# EAGLE design Board (EAGLE 7.1.0)
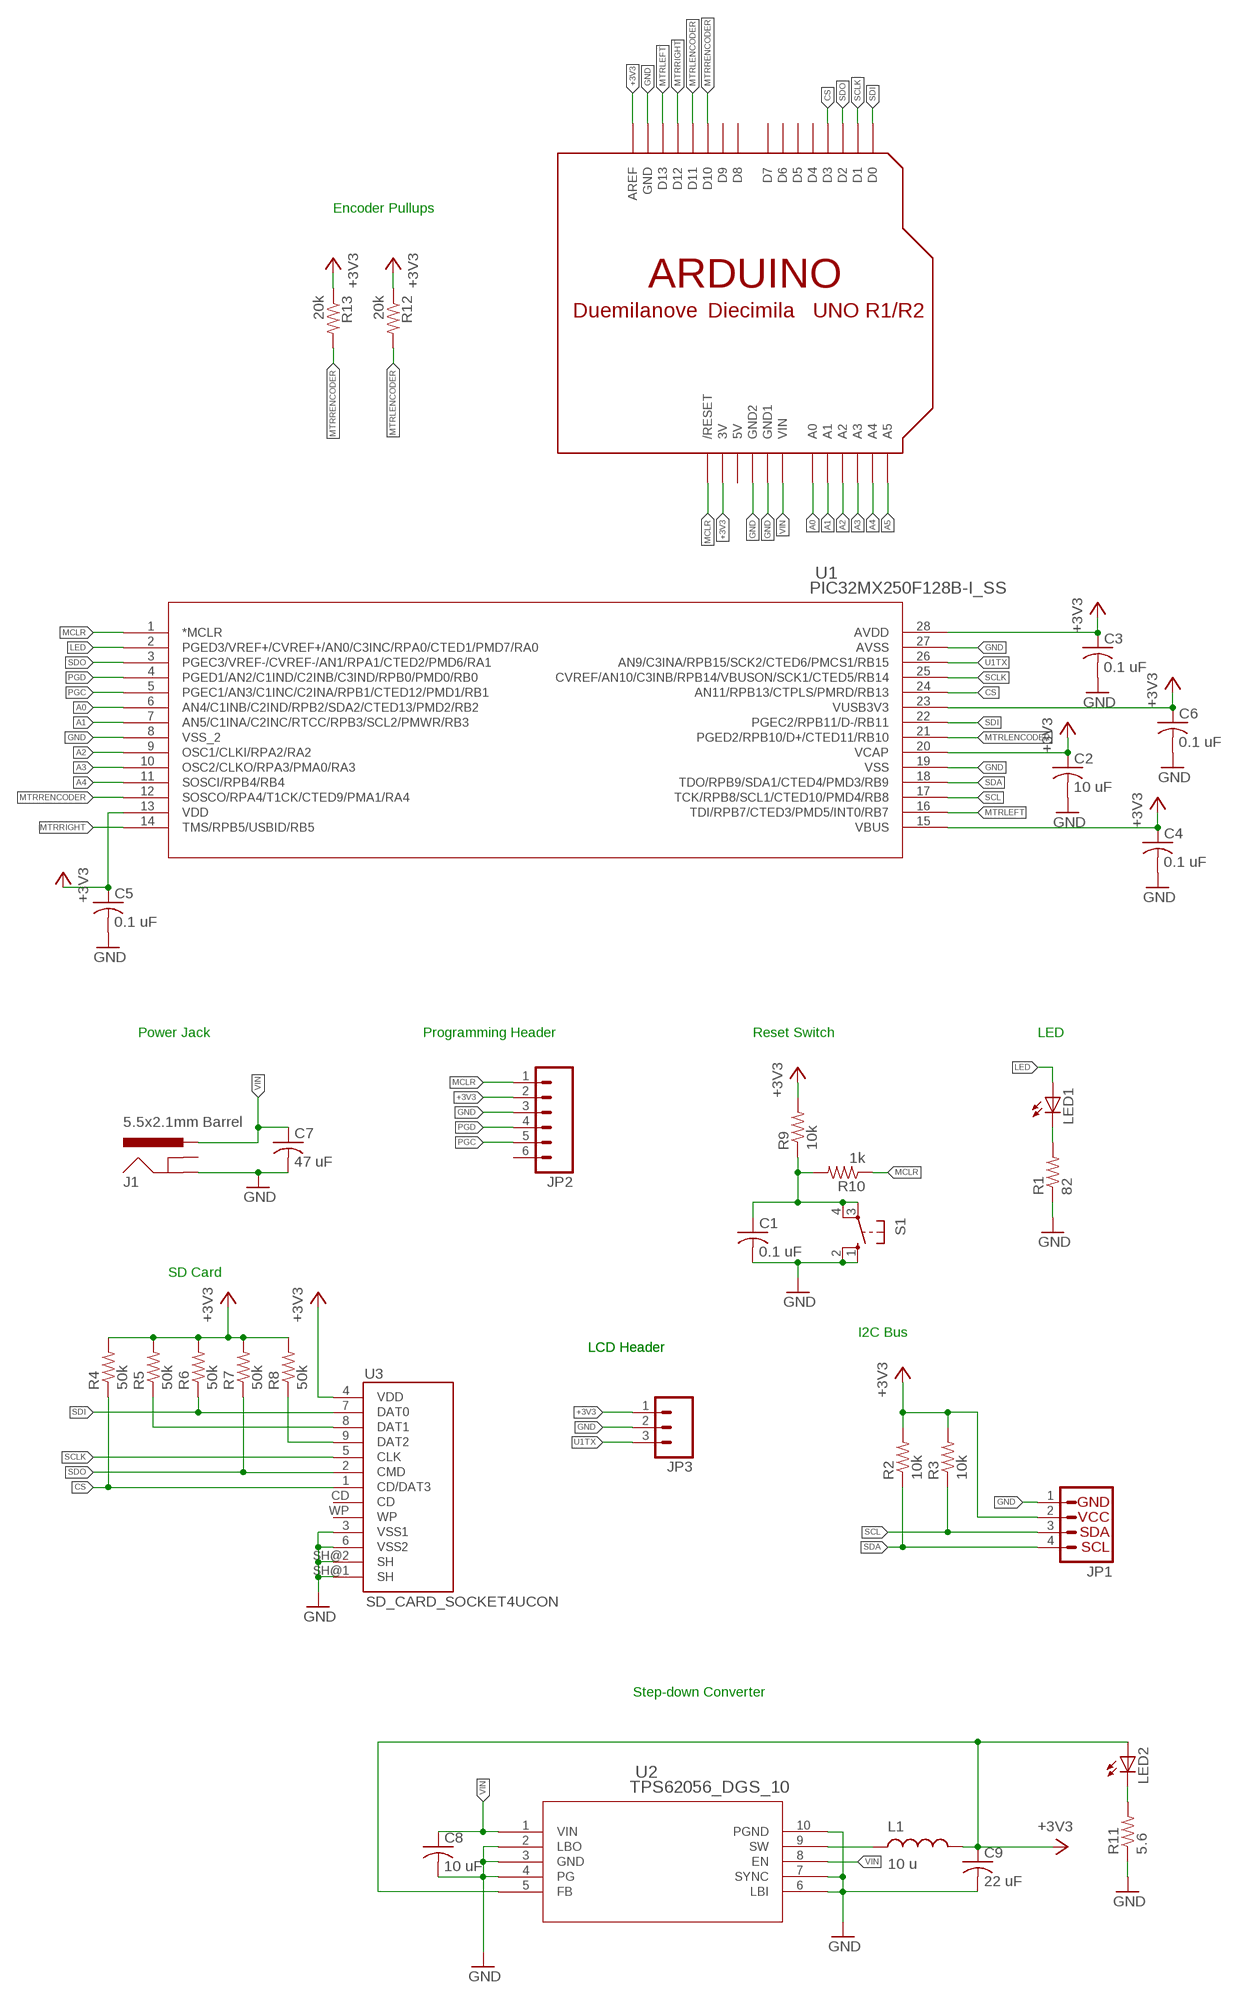
[diagram p0: schematic, sheet 1]

## Parts
C1  0.1 uF  C-USC0805  [C0805]
C2  10 uF  C-USC0805  [C0805]
C3  0.1 uF  C-USC0805  [C0805]
C4  0.1 uF  C-USC0805  [C0805]
C5  0.1 uF  C-USC0805  [C0805]
C6  0.1 uF  C-USC0805  [C0805]
C7  47 uF  C-USC0805  [C0805]
C8  10 uF  C-USC0805  [C0805]
C9  22 uF  C-USC0805  [C0805]
J1  5.5x2.1mm Barrel  POWER_JACKSMD  [POWER_JACK_SMD]
JP1  I2C_STANDARD  [1X04]
JP2  M06SILK_FEMALE_PTH  [1X06]
JP3  M03PTH  [1X03]
L1  10 u  SLF7032T-100M1R4-2PF  [SLF7032T-100M1R4-2PF]
LED1  LEDCHIPLED_1206  [CHIPLED_1206]
LED2  LEDCHIPLED_1206  [CHIPLED_1206]
R1  82  R-US_R1210W  [R1210W]
R2  10k  R-US_R0805W  [R0805W]
R3  10k  R-US_R0805W  [R0805W]
R4  50k  R-US_R0805W  [R0805W]
R5  50k  R-US_R0805W  [R0805W]
R6  50k  R-US_R0805W  [R0805W]
R7  50k  R-US_R0805W  [R0805W]
R8  50k  R-US_R0805W  [R0805W]
R9  10k  R-US_R0805W  [R0805W]
R10  1k  R-US_R0805W  [R0805W]
R11  5.6  R-US_R1210W  [R1210W]
R12  20k  R-US_R0805W  [R0805W]
R13  20k  R-US_R0805W  [R0805W]
S1  10-XX  [B3F-10XX]
U1  PIC32MX250F128B-I_SS  [SSOP28_MC]
U2  TPS62056_DGS_10  [DGS10]
U3  SD_CARD_SOCKET4UCON  [SDCARD_4UCONN]
U$1  ARDUINO-NOHOLE  [ARDUINO-NOHOLE]

## Nets
+3V3: C2.1 C3.1 C4.1 C5.1 C6.1 C9.1 JP1.2 JP2.2 JP3.1 L1.P$2 LED2.A R2.2 R3.2 R4.2 R5.2 R6.2 R7.2 R8.2 R9.2 R12.1 R13.1 U1.13(VDD) U1.15(VBUS) U1.20(VCAP) U1.23(VUSB3V3) U1.28(AVDD) U2.5(FB) U3.4(VDD) U$1.3V U$1.AREF
A0: U1.6(AN4/C1INB/C2IND/RPB2/SDA2/CTED13/PMD2/RB2) U$1.A0
A1: U1.7(AN5/C1INA/C2INC/RTCC/RPB3/SCL2/PMWR/RB3) U$1.A1
A2: U1.9(OSC1/CLKI/RPA2/RA2) U$1.A2
A3: U1.10(OSC2/CLKO/RPA3/PMA0/RA3) U$1.A3
A4: U1.11(SOSCI/RPB4/RB4) U$1.A4
A5: U$1.A5
CS: R4.1 U1.24(AN11/RPB13/CTPLS/PMRD/RB13) U3.1(CD/DAT3) U$1.D3
GND: C1.2 C2.2 C3.2 C4.2 C5.2 C6.2 C7.2 C8.2 C9.2 J1.P$4(GND) JP1.1 JP2.3 JP3.2 R1.1 R11.1 S1.1(S) S1.2(S1) U1.8(VSS_2) U1.19(VSS) U1.27(AVSS) U2.2(LBO) U2.3(GND) U2.4(PG) U2.6(LBI) U2.7(SYNC) U2.10(PGND) U3.3(VSS1) U3.6(VSS2) U3.SH@1(SH) U3.SH@2(SH) U$1.GND U$1.GND1 U$1.GND2
LED: LED1.A U1.2(PGED3/VREF+/CVREF+/AN0/C3INC/RPA0/CTED1/PMD7/RA0)
MCLR: JP2.1 R10.1 U1.1(*MCLR) U$1.RESET(/RESET)
MTRLEFT: U1.16(TDI/RPB7/CTED3/PMD5/INT0/RB7) U$1.D13
MTRLENCODER: R12.2 U1.21(PGED2/RPB10/D+/CTED11/RB10) U$1.D11
MTRRENCODER: R13.2 U1.12(SOSCO/RPA4/T1CK/CTED9/PMA1/RA4) U$1.D10
MTRRIGHT: U1.14(TMS/RPB5/USBID/RB5) U$1.D12
N$1: LED1.C R1.2
N$2: R8.1 U3.9(DAT2)
N$3: R5.1 U3.8(DAT1)
N$4: C1.1 R9.1 R10.2 S1.3(P) S1.4(P1)
N$5: LED2.C R11.2
N$21: L1.P$1 U2.9(SW)
PGC: JP2.5 U1.5(PGEC1/AN3/C1INC/C2INA/RPB1/CTED12/PMD1/RB1)
PGD: JP2.4 U1.4(PGED1/AN2/C1IND/C2INB/C3IND/RPB0/PMD0/RB0)
SCL: JP1.3 R3.1 U1.17(TCK/RPB8/SCL1/CTED10/PMD4/RB8)
SCLK: U1.25(CVREF/AN10/C3INB/RPB14/VBUSON/SCK1/CTED5/RB14) U3.5(CLK) U$1.D1
SDA: JP1.4 R2.1 U1.18(TDO/RPB9/SDA1/CTED4/PMD3/RB9)
SDI: R6.1 U1.22(PGEC2/RPB11/D-/RB11) U3.7(DAT0) U$1.D0
SDO: R7.1 U1.3(PGEC3/VREF-/CVREF-/AN1/RPA1/CTED2/PMD6/RA1) U3.2(CMD) U$1.D2
U1TX: JP3.3 U1.26(AN9/C3INA/RPB15/SCK2/CTED6/PMCS1/RB15)
VIN: C7.1 C8.1 J1.VIN0(PWR) U2.1(VIN) U2.8(EN) U$1.VIN
Unconnected: J1.GND(GNDBREAK) JP2.6 U3.CD U3.WP U$1.D4 U$1.D5 U$1.D6 U$1.D7 U$1.D8 U$1.D9

## Notes on the sheet
- Encoder Pullups
- Power Jack | Programming Header | Reset Switch | LED
- SD Card
- I2C Bus
- LCD Header | LCD Header
- Step-down Converter

## Power pins joined to a net without a drawn wire
5V: U$1.5V

## Library data of the parts
C1-C9 = adafruit:C-US: CAPACITOR, American symbol
J1 = SparkFun-Connectors:POWER_JACK: Power Jack This is the standard 5.5mm barrel jack for power. The PTH is the most common, proven, reliable, footprint. The Slot footprint only works if the mill layer is transmitted to the PCB fab house so be warned. Mating wall wart : TOL-00298 (and others); PROD_ID: CONN-08106
JP1 = SparkFun-Connectors:I2C_STANDARD: SparkFun has standardized on a pinout for all I2C based sensor breakouts. This pinout allows I2C boards to be plugged directly into the headers on Arduino Uno compatible boards, and to be daisy chained easily.
JP2 = SparkFun-Connectors:M06: Header 6 Standard 6-pin 0.1" header. Use with straight break away headers (SKU : PRT-00116), right angle break away headers (PRT-00553), swiss pins (PRT-00743), machine pins (PRT-00117), and female headers (PRT-00115). Molex polarized connector foot print use with SKU : PRT-08094 with associated crimp pins and housings. NOTES ON THE VARIANTS LOCK and LOCK_LONGPADS... This footprint was designed to help hold the alignment of a through-hole component (i.e. 6-pin header) while soldering it into place. You may notice that each hole has been shifted either up or down by 0.005 of an inch from it's more standard position (which is a perfectly straight line). This slight alteration caused the pins (the squares in the middle) to touch the edges of the holes. Because they are alternating, it causes a "brace" to hold the component in place. 0.005 has proven to be the perfect amount of "off-center" position when using our standard breakaway headers. Although looks a little odd when you look at the bare footprint, once you have a header in there, the alteration is very hard to notice. Also,if you push a header all the way into place, it is covered up entirely on the bottom side. This idea of altering the position of holes to aid alignment will be further integrated into the Sparkfun Library for other footprints. It can help hold any component with 3 or more connection pins.; PROD_ID: CONN-08437
JP3 = SparkFun-Connectors:M03: Header 3 Standard 3-pin 0.1" header. Use with straight break away headers (SKU : PRT-00116), right angle break away headers (PRT-00553), swiss pins (PRT-00743), machine pins (PRT-00117), and female headers (PRT-00115). Molex polarized connector foot print use with SKU : PRT-08232 with associated crimp pins and housings.
L1 = MyLibrary:SLF7032T-100M1R4-2PF: SLF7032T-100M1R4-2PF
LED1 LED2 = adafruit:LED: LED OSRAM: - CHIPLED LG R971, LG N971, LY N971, LG Q971, LY Q971, LO R971, LY R971 LH N974, LH R974 LS Q976, LO Q976, LY Q976 LO Q996 - Hyper CHIPLED LW Q18S LB Q993, LB Q99A, LB R99A - SideLED LS A670, LO A670, LY A670, LG A670, LP A670 LB A673, LV A673, LT A673, LW A673 LH A674 LY A675 LS A676, LA A676, LO A676, LY A676, LW A676 LS A679, LY A679, LG A679 - Hyper Micro SIDELED® LS Y876, LA Y876, LO Y876, LY Y876 LT Y87S - SmartLED LW L88C, LW L88S LB L89C, LB L89S, LG L890 LS L89K, LO L89K, LY L89K LS L896, LA L896, LO L896, LY L896 - TOPLED LS T670, LO T670, LY T670, LG T670, LP T670 LSG T670, LSP T670, LSY T670, LOP T670, LYG T670 LG T671, LOG T671, LSG T671 LB T673, LV T673, LT T673, LW T673 LH T674 LS T676, LA T676, LO T676, LY T676, LB T676, LH T676, LSB T676, LW T676 LB T67C, LV T67C, LT T67C, LS T67K, LO T67K, LY T67K, LW E67C LS E67B, LA E67B, LO E67B, LY E67B, LB E67C, LV E67C, LT E67C LW T67C LS T679, LY T679, LG T679 LS T770, LO T770, LY T770, LG T770, LP T770 LB T773, LV T773, LT T773, LW T773 LH T774 LS E675, LA E675, LY E675, LS T675 LS T776, LA T776, LO T776, LY T776, LB T776 LHGB T686 LT T68C, LB T68C - Hyper Mini TOPLED® LB M676 - Mini TOPLED Santana® LG M470 LS M47K, LO M47K, LY M47K Source: http://www.osram.convergy.de/
R1-R13 = adafruit:R-US_: RESISTOR, American symbol
S1 = switch-omron:10-XX: OMRON SWITCH
U1 = MX250F128B_I_SS:PIC32MX250F128B-I_SS
U2 = TPS62056:TPS62056_DGS_10; DATASHEETURL: http://www.ti.com/lit/gpn/TPS62056; DESCRIPTION: 3.3-V Output, 800-mA, 10V Vin, 95% Efficient Step-Down Converter in MSOP-10; FAMILY_NAME: STEP-DOWN REGULATOR; GENERIC_PART_NUMBER: TPS62056; INDUSTRY_STD_PKG_TYPE: MSOP; MANUFACTURER: Texas Instruments; MANUFACTURER_PART_NUMBER: tps62056_dgs_10; PACKAGE_DESIGNATOR: DGS; PIN_COUNT: 10; VENDOR: Texas Instruments
U3 = SparkFun-Connectors:SD_CARD_SOCKET: SD Memory Card Connector, push-push normal type, CD enable, WP enable
U$1 = adafruit:ARDUINO: Arduino Diecimila/Duemilanove Make a shield with ease, this package has all the named pins as well as the two mounting drill holes and an outline of the USB and DC power connector. The outline is on the DIMENSION layer, so if your board house uses it they will cut the outline to match. http://www.ladyada.net/library/pcb/eaglelibrary.html

## Board
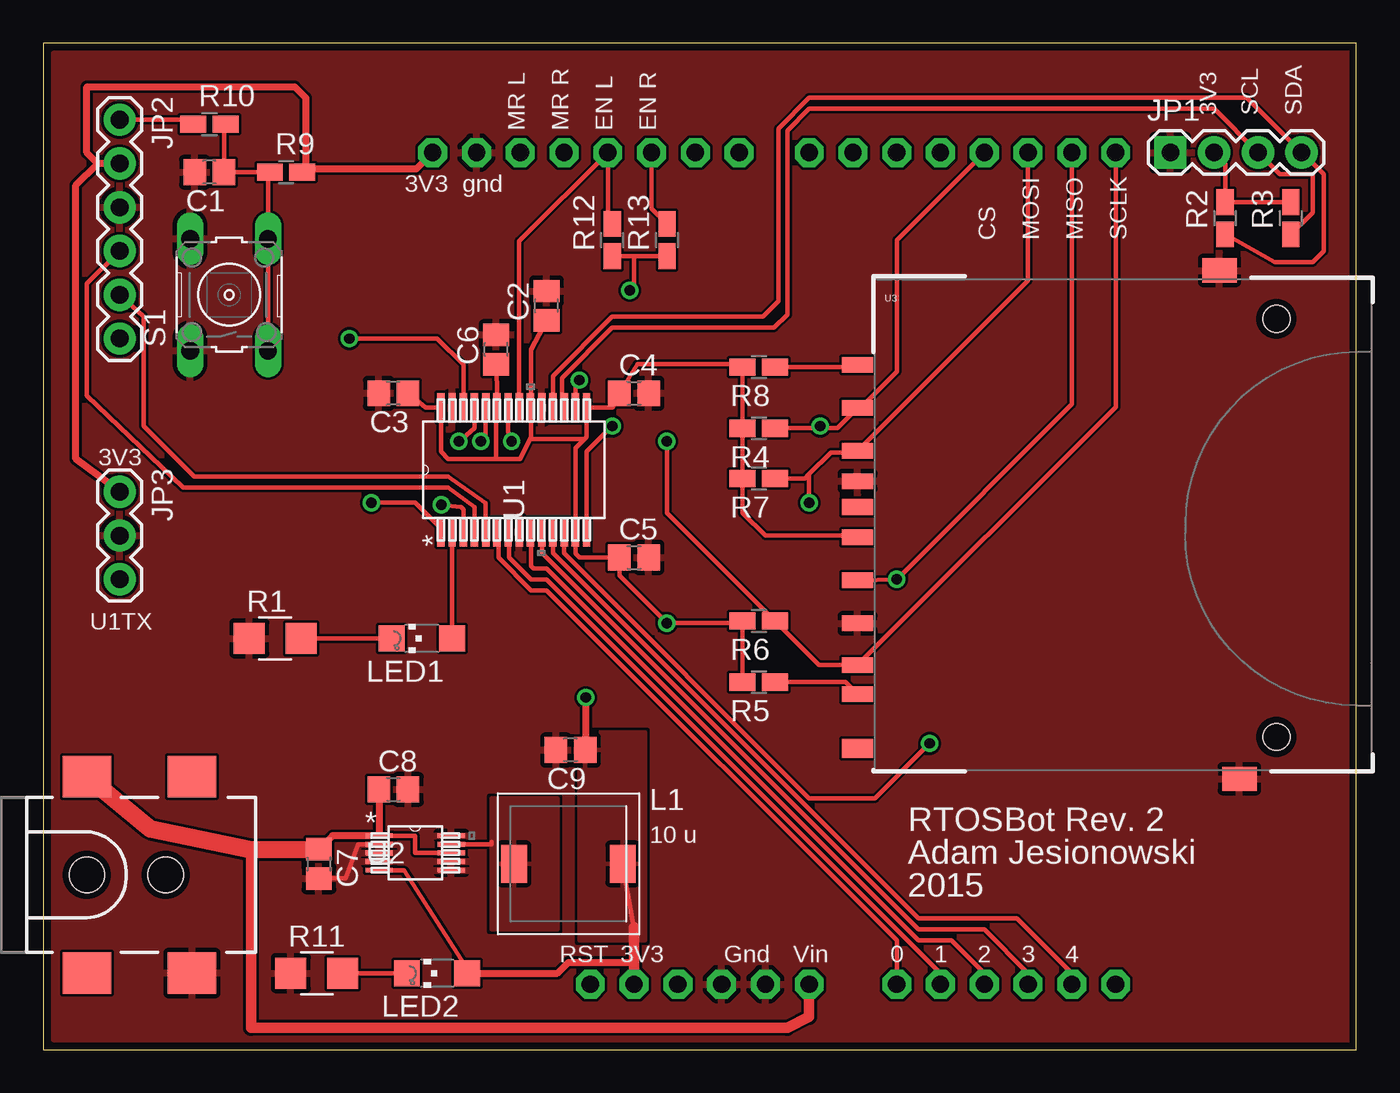
[diagram p1: board, top side]
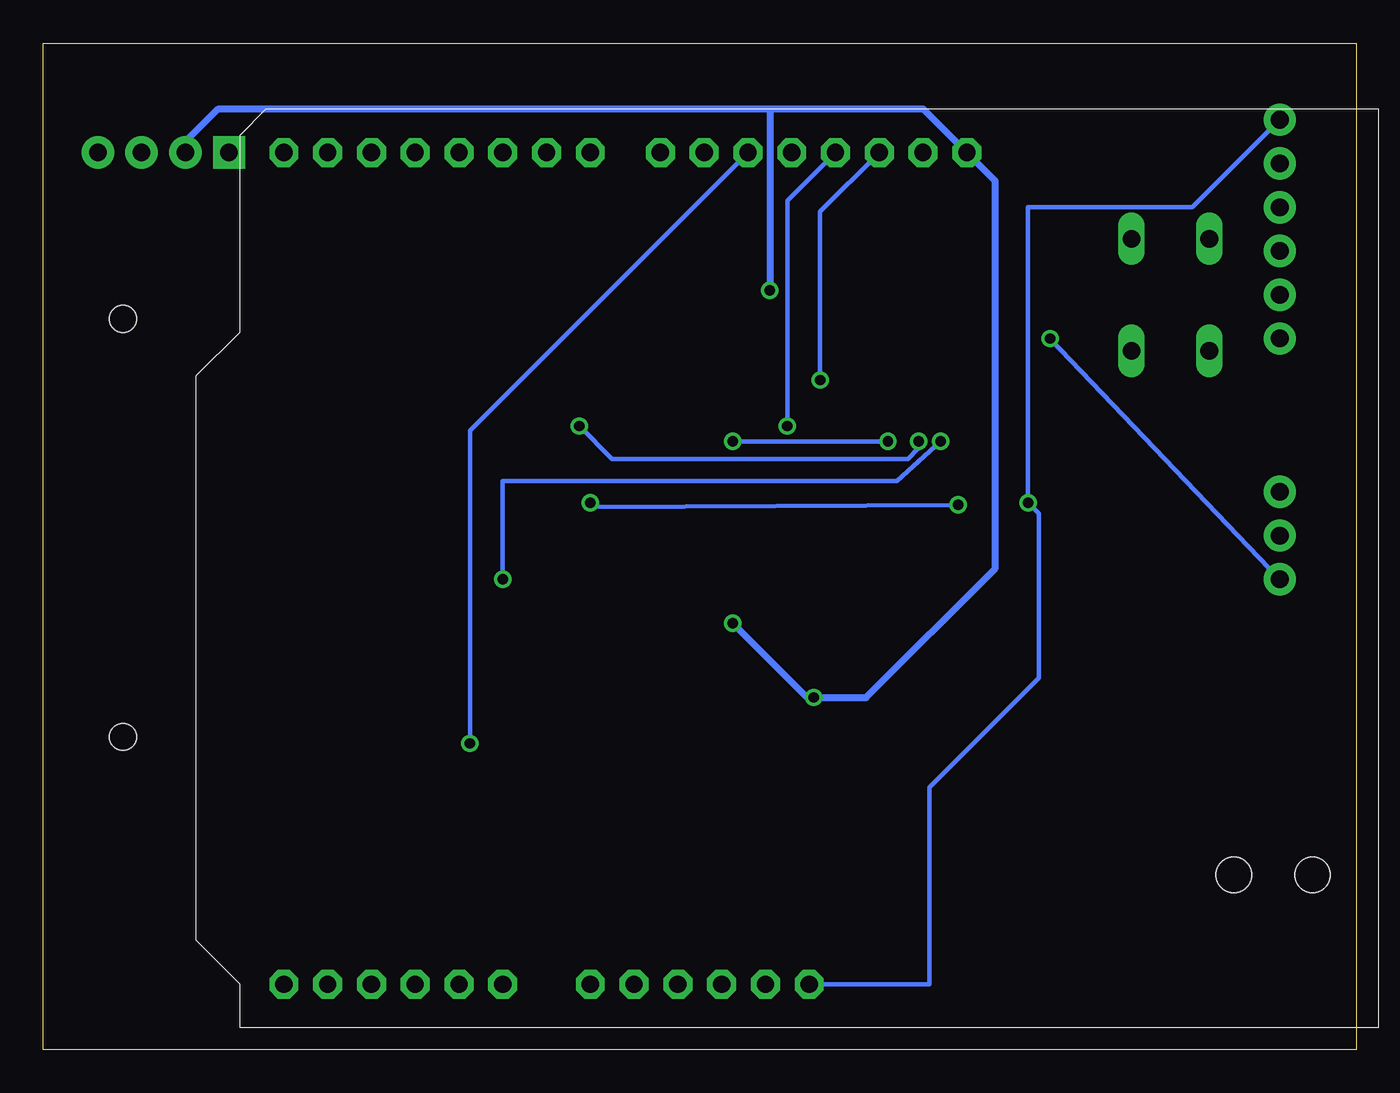
[diagram p2: board, bottom side, seen from below]

Size 76.2 x 58.42 mm. Coordinates in mm from the lower left corner, seen from the top.
Outline: 0,0 76.2,0 76.2,58.42 0,58.42 0,0
Copper layers (1*16): Top 0.035559375mm / dielectric 1.501140625mm / Bottom 0.035559375mm
Design rules "typical_4pcb": minimum track width 10mil, minimum drill 15mil, track to track 6mil, track to pad 6mil, pad to pad 6mil, via to via 6mil, smd to smd 6mil, copper to edge 15mil, drill to drill 8mil, minimum pad ring 10mil, minimum via ring 8mil, stop-mask expansion 4mil, vias tented up to drill 0mil, thermal gap 10mil

### Footprints (pad centres in the part's own frame; a part is rotated, then mirrored left to right if it is on the bottom)
C0805 = smd 1.3 x 1.5: 1 -0.85,0; 2 0.85,0
POWER_JACK_SMD = smd 2.8 x 2.4: GND 0,-5.7; P$4 6.1,-5.7; VIN0 0,5.7; VIN1 6.1,5.7 | hole 2.032: 0,0; 4.572,0
1X04 = drill 1.016 pad 1.88 square: 1 0,0 | drill 1.016 pad 1.88: 2 2.54,0; 3 5.08,0; 4 7.62,0
1X06 = drill 1.016 pad 1.88: 1 0,0; 2 2.54,0; 3 5.08,0; 4 7.62,0; 5 10.16,0; 6 12.7,0
1X03 = drill 1.016 pad 1.88: 1 0,0; 2 2.54,0; 3 5.08,0
SLF7032T-100M1R4-2PF = smd 1.5 x 2.2: P$1 -3.15,0; P$2 3.15,0
CHIPLED_1206 = smd 1.5 x 1.5: A 0,-1.75; C 0,1.75
R1210W = smd 1.8 x 1.8: 1 -1.499,0; 2 1.499,0
R0805W = smd 1.5 x 1: 1 -0.94,0; 2 0.94,0
B3F-10XX = drill 1.016 long: 1 -3.251,2.261; 2 3.251,2.261; 3 -3.251,-2.261; 4 3.251,-2.261
SSOP28_MC = smd 1.676 x 0.432: 1 -3.617,4.225; 2 -3.617,3.575; 3 -3.617,2.925; 4 -3.617,2.275; 5 -3.617,1.625; 6 -3.617,0.975; 7 -3.617,0.325; 8 -3.617,-0.325; 9 -3.617,-0.975; 10 -3.617,-1.625; 11 -3.617,-2.275; 12 -3.617,-2.925; 13 -3.617,-3.575; 14 -3.617,-4.225; 15 3.617,-4.225; 16 3.617,-3.575; 17 3.617,-2.925; 18 3.617,-2.275; 19 3.617,-1.625; 20 3.617,-0.975; 21 3.617,-0.325; 22 3.617,0.325; 23 3.617,0.975; 24 3.617,1.625; 25 3.617,2.275; 26 3.617,2.925; 27 3.617,3.575; 28 3.617,4.225
DGS10 = smd 1.575 x 0.279: 1 -2.095,1; 2 -2.095,0.5; 3 -2.095,0; 4 -2.095,-0.5; 5 -2.095,-1; 6 2.095,-1; 7 2.095,-0.5; 8 2.095,0; 9 2.095,0.5; 10 2.095,1
SDCARD_4UCONN = smd 1.8 x 0.9: 1 -1,6.77; 2 -1,4.27; 3 -1,2.52; 4 -1,-0.73; 5 -1,-3.23; 6 -1,-5.73; 7 -1,-8.15; 8 -1,-9.85; 9 -1,9.27; CD -1,1.02 | smd 2 x 1.4: SH@1 20,14.75; SH@2 21.15,-14.75 | smd 1.8 x 1.1: WP -1,-13 | hole 1.55: 23.3,11.94; 23.3,-12.32
ARDUINO-NOHOLE = drill 1 pad 1.676 octagon: 3V 35.56,2.54; 5V 38.1,2.54; A0 50.8,2.54; A1 53.34,2.54; A2 55.88,2.54; A3 58.42,2.54; A4 60.96,2.54; A5 63.5,2.54; AREF 23.876,50.8; D0 63.5,50.8; D1 60.96,50.8; D2 58.42,50.8; D3 55.88,50.8; D4 53.34,50.8; D5 50.8,50.8; D6 48.26,50.8; D7 45.72,50.8; D8 41.656,50.8; D9 39.116,50.8; D10 36.576,50.8; D11 34.036,50.8; D12 31.496,50.8; D13 28.956,50.8; GND 26.416,50.8; GND1 43.18,2.54; GND2 40.64,2.54; RESET 33.02,2.54; VIN 45.72,2.54

### Placement (x,y rotation side)
C1  9.65,50.93 180 top
C2  29.21,43.18 90 top
C3  20.32,38.1 180 top
C4  34.29,38.1 0 top
C5  34.29,28.57 0 top
C6  26.29,40.64 90 top
C7  16,10.79 270 top
C8  20.32,15.11 0 top
C9  30.61,17.4 180 top
J1  2.54,10.16 0 top
JP1  65.41,52.07 0 top
JP2  4.45,53.98 270 top
JP3  4.45,32.38 270 top
L1  30.48,10.79 0 top
LED1  21.97,23.88 90 top
LED2  22.86,4.45 90 top
R1  13.46,23.88 0 top
R2  68.58,48.26 90 top
R3  72.39,48.26 90 top
R4  41.53,36.07 180 top
R5  41.53,21.34 180 top
R6  41.53,24.89 180 top
R7  41.53,33.15 180 top
R8  41.53,39.62 180 top
R9  14.1,50.93 0 top
R10  9.65,53.72 0 top
R11  15.88,4.45 0 top
R12  33.02,46.99 90 top
R13  36.2,46.99 90 top
S1  10.79,43.81 90 top
U1  27.3,33.66 90 top
U2  21.59,11.43 0 top
U3  48.26,30.48 0 top
U$1  -1.27,1.27 0 top

### Tracks (layer width: path | path; a pad name or v marks a point on that pad's centre or on a via)
+3V3  (via drill 0.6)
  Top 0.254: L1.P$2 34.29,6.99 | LED2.A 24.77,4.45 20.95,10.41 19.49,10.41 U2.5 | 26.29,37.23 U1.23 | 28.32,35.56 28.32,35.43 31.4,35.43 | 28.32,35.56 28.32,37.23 U1.20 28.32,37.31 28.32,40.64 C2.1 | 28.32,35.56 27.69,34.29 26.29,34.29 | U3.4 47.16,29.84 41.91,29.84 40.59,31.17 R7.2 R4.2 R8.2 40.42,39.79 34.49,39.79 C4.1 33.04,37.27 U1.15 31.53,35.56 31.4,35.43 | R5.2 R6.2 40.46,24.77 v36.2,24.77 33.44,27.52 C5.1 31.11,28.57 30.88,28.81 U1.13 30.88,34.91 31.4,35.43 | U1.23 26.33,38.48 C6.1 | U1.23 26.29,37.27 26.29,34.29 | 26.29,34.29 23.5,34.29 23.08,34.7 U1.28 22.2,37.27 C3.1 | R3.2 R2.2 68.58,51.44 JP1.2 | R12.1 34.29,46.05 | 34.29,46.05 R13.1 | v34.04,44.07 34.29,44.45 34.29,46.05
  Top 0.406: C9.1 31.5,17.4 v31.5,20.45 | 15.16,50.8 R9.2 15.24,51.13 | JP2.2 3.17,51.44 | 3.17,51.44 2.54,52.07 2.54,55.88 14.61,55.88 15.24,55.24 15.24,51.13 | JP3.1 1.91,34.29 1.91,50.16 3.17,51.44 | 15.24,51.13 21.67,51.13 U$1.AREF | 24.77,4.45 29.84,4.45 30.48,5.08 34.29,5.08
  Top 0.61: U$1.3V 34.29,5.08 34.29,6.99 34.29,7.11
  Bottom 0.406: JP1.2 67.94,52.7 66.04,54.61 34.04,54.61 | 34.04,54.61 25.15,54.61 U$1.AREF 20.95,50.42 20.95,27.94 28.45,20.45 v31.5,20.45 31.88,20.45 v36.2,24.77 | 34.04,54.61 v34.04,44.07
  pour Top: 31.11,18.41 31.11,6.35 34.92,6.35 34.92,18.41
A0
  Top 0.254: U$1.A0 49.53,6.35 29.21,26.67 28.32,26.67 26.42,28.57 26.42,29.95 U1.6
A1
  Top 0.254: U$1.A1 52.07,4.45 29.21,27.3 28.32,27.3 27.05,28.57 27.05,29.97 U1.7
A2
  Top 0.254: U$1.A2 54.61,4.45 52.7,6.35 50.8,6.35 29.21,27.94 28.45,27.94 28.32,28.07 28.32,30 U1.9
A3
  Top 0.254: U$1.A3 57.15,4.45 54.61,6.99 50.8,6.99 28.96,28.83 28.96,30.01 U1.10
A4
  Top 0.254: U$1.A4 59.69,4.45 56.52,7.62 50.8,7.62 29.59,28.83 29.59,30.03 U1.11
CS  (via drill 0.6)
  Top 0.254: R4.1 45.09,36.07 | 45.09,36.07 46.08,36.07 U3.1 47.17,37.34 47.5,37.34 49.53,39.37 49.53,46.99 U$1.D3 | U1.24 25.68,35.71 v25.4,35.31 | v45.09,36.2 45.09,36.07
  Bottom 0.254: v25.4,35.31 25.4,34.92 26.04,34.29 43.18,34.29 v45.09,36.2
GND
  Top 0.254: U2.2 18.28,11.93 17.57,9.95 C7.2
  pour Top (rank 2): 0.64,57.78 0.64,0.64 76.2,0.64 76.2,57.78
LED
  Top 0.254: U1.2 23.73,28.02 LED1.A
MCLR  (via drill 0.6)
  Top 0.254: JP2.1 8.46,53.98 R10.1 | v19.05,31.75 21.59,31.75 23.08,30.26 U1.1
  Bottom 0.254: JP2.1 9.53,48.9 19.05,48.9 v19.05,31.75 18.41,31.11 18.41,21.59 24.77,15.24 24.77,3.81 U$1.RESET
MTRLEFT  (via drill 0.6)
  Top 0.254: U1.16 30.88,38.5 v31.11,38.86
  Bottom 0.254: v31.11,38.86 31.11,48.64 U$1.D13
MTRLENCODER
  Top 0.254: R12.2 32.77,48.18 U$1.D11 27.63,46.93 U1.21
MTRRENCODER  (via drill 0.6)
  Top 0.254: U1.12 30.23,28.82 44.45,14.61 48.26,14.61 v51.44,17.78 | U$1.D10 35.31,48.82 R13.2
  Bottom 0.254: v51.44,17.78 51.44,35.94 U$1.D10
MTRRIGHT  (via drill 0.6)
  Top 0.254: U1.14 31.53,34.7 v33.02,36.2
  Bottom 0.254: v33.02,36.2 33.02,49.28 U$1.D12
N$1
  Top 0.254: R1.2 LED1.C
N$2
  Top 0.254: R8.1 47.13,39.62 U3.9
N$3
  Top 0.254: R5.1 46.55,21.34 U3.8
N$4
  Top 0.254: S1.3 S1.4 13.06,50.83 R9.1 C1.1 10.5,53.63 R10.2
N$5
  Top 0.254: 17.14,4.45 R11.2 LED2.C
N$21
  Top 0.254: U2.9 26.04,11.93 26.04,12.06
  pour Top: 29.84,14.61 29.84,6.99 26.04,6.99 26.04,14.61
PGC
  Top 0.254: U1.5 25.68,31.72 23.5,33.27 8.76,33.27 5.84,36.2 5.84,42.55 JP2.5
PGD
  Top 0.254: U1.4 25.03,31.48 23.5,32.64 8.13,32.64 2.54,37.97 2.54,44.45 JP2.4
SCL
  Top 0.254: U1.17 30.1,37.4 30.1,38.99 33.02,41.91 42.42,41.91 43.18,42.67 43.18,53.34 44.45,54.61 67.94,54.61 JP1.3 71.75,50.8 73.66,50.8 73.66,48.59 R3.1
SCLK  (via drill 0.6)
  Top 0.254: U1.25 25.03,36.08 v24.13,35.31 | U3.5 v49.53,27.3 59.69,37.47 U$1.D1
  Bottom 0.254: v24.13,35.31 26.67,33.02 49.53,33.02 v49.53,27.3
SDA
  Top 0.254: U1.18 29.58,39.1 33.02,42.55 41.78,42.55 42.67,43.43 42.67,53.47 44.45,55.24 69.85,55.24 JP1.4 74.3,50.8 74.3,46.35 73.66,45.72 71.45,45.72 R2.1
SDI  (via drill 0.6)
  Top 0.254: U1.22 26.98,35.88 v27.18,35.31 | U$1.D0 62.23,37.3 U3.7 45.03,22.33 R6.1 36.2,31.17 v36.2,35.31
  Bottom 0.254: v27.18,35.31 v36.2,35.31
SDO  (via drill 0.6)
  Top 0.254: R7.1 44.2,33.15 44.45,33.4 | 44.45,33.4 45.72,34.67 47.18,34.67 U3.2 57.15,44.64 U$1.D2 | U1.3 24.38,31.37 24.26,31.5 v23.11,31.62 | v44.45,31.75 44.45,33.4
  Bottom 0.254: v23.11,31.62 44.2,31.5 v44.45,31.75
U1TX  (via drill 0.6)
  Top 0.254: U1.26 24.38,39.75 22.86,41.27 v17.78,41.27
  Bottom 0.254: v17.78,41.27 JP3.3
VIN
  Top 0.254: U2.1 21.59,12.43 21.59,11.43 U2.8
  Top 0.406: C8.1 19.49,15.11 U2.1 16.79,12.43 C7.1
  Top 0.61: U$1.VIN 44.45,1.91 43.18,1.27 12.06,1.27 12.06,11.61
  Top 1.016: J1.VIN0 6.22,12.83 12.06,11.61 C7.1

### Text on the board
tSilk: 3V3 | SCL | SDA | MR L | MR R | EN L | EN R | CS | MOSI | MISO | SCLK | 3V3 | U1TX | RTOSBot Rev. 2 | Adam Jesionowski | 2015